# Altium schematic sheet MotoAVC - Aquisição.SchDoc: MotoAVC v1.0
size A4; Author: Felippe Kalil Mendonça; DrawnBy: Felippe Kalil Mendonça; Organization: LABSOLDA/UFSC; Address1: Campus Universitário; Address2: Trindade - Florianópolis - SC; Address3: Brasil; DocumentNumber: 1.0; SheetNumber: 1; SheetTotal: 1; ProjectName: MotoAVC
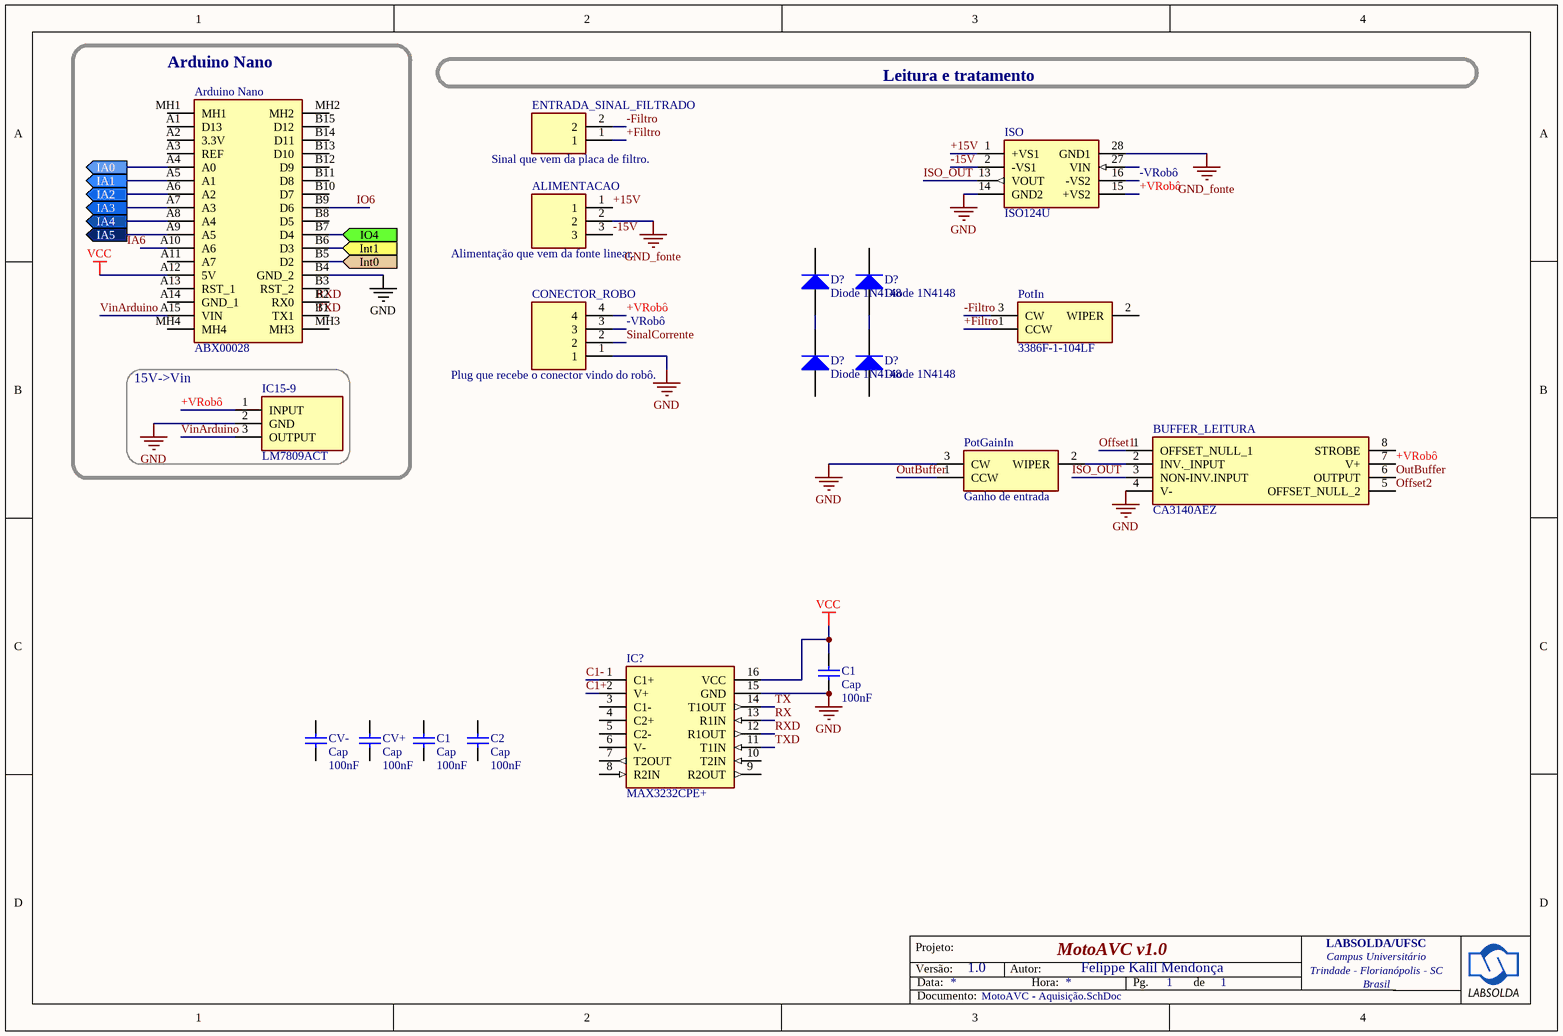
[diagram p0: MotoAVC - Aquisição.SchDoc]

## Parts
(Parts that share a designator on the sheet are numbered #1, #2 ... from top to bottom, then left to right.)
ALIMENTACAO  Alimentação que vem da fonte linear.  [0022053031]
Arduino_Nano  ABX00028  [ABX00028]
BUFFER_LEITURA  CA3140AEZ  [DIP794W56P254L958H533Q8N]
C1#1  Cap  value 100nF  [RAD-0.3]
C1#2  Cap  value 100nF  [RAD-0.3]
C2  Cap  value 100nF  [RAD-0.3]
CONECTOR_ROBO  Plug que recebe o conector vindo do robô.  [SHDR4W87P0X254_1X4_1001X635X1091P]
CV+  Cap  value 100nF  [RAD-0.3]
CV-  Cap  value 100nF  [RAD-0.3]
D?#1  Diode 1N4148  [DO-35]
D?#2  Diode 1N4148  [DO-35]
D?#3  Diode 1N4148  [DO-35]
D?#4  Diode 1N4148  [DO-35]
ENTRADA_SINAL_FILTRADO  Sinal que vem da placa de filtro.  [SHDR2W104P0X254_1X2_508X580X1205P]
IC15-9  LM7809ACT  [TO254P470X1016X2019-3P]
IC?  MAX3232CPE+  [DIP762W56P254L1918H457Q16N]
ISO  ISO124U  [ISO122U]
PotGainIn  Ganho de entrada  [3386F1153]
PotIn  3386F-1-104LF  [3386F1153]

## Blocks framed on the sheet
Arduino Nano: Arduino_Nano
15V->Vin: IC15-9

## Ports
IA0 (out), IA1 (out), IA2 (out), IA3 (out), IA4 (out), IA5 (out), Int0 (in), Int1 (in), IO4 (in)

## Nets
GND: Arduino_Nano.B4(GND_2) BUFFER_LEITURA.4(V-) C1#1.1 CONECTOR_ROBO.1 IC15-9.2(GND) IC?.15(GND) ISO.14(GND2) PotGainIn.3(CW)
GND_fonte: ALIMENTACAO.2 ISO.28(GND1)
VCC: Arduino_Nano.A12(5V) C1#1.2 IC?.16(VCC)
+15V: ALIMENTACAO.1 ISO.1(+VS1)
+Filtro: ENTRADA_SINAL_FILTRADO.1 PotIn.1(CCW)
+VRobô: BUFFER_LEITURA.7(V+) CONECTOR_ROBO.4 IC15-9.1(INPUT) ISO.15(+VS2)
-15V: ALIMENTACAO.3 ISO.2(-VS1)
-Filtro: ENTRADA_SINAL_FILTRADO.2 PotIn.3(CW)
-VRobô: CONECTOR_ROBO.3 ISO.16(-VS2)
C1+: IC?.2(V+)
C1-: IC?.1(C1+)
IA0: Arduino_Nano.A4(A0) ; port IA0
IA1: Arduino_Nano.A5(A1) ; port IA1
IA2: Arduino_Nano.A6(A2) ; port IA2
IA3: Arduino_Nano.A7(A3) ; port IA3
IA4: Arduino_Nano.A8(A4) ; port IA4
IA5: Arduino_Nano.A9(A5) ; port IA5
Int0: Arduino_Nano.B5(D2) ; port Int0
Int1: Arduino_Nano.B6(D3) ; port Int1
IO4: Arduino_Nano.B7(D4) ; port IO4
IO6: Arduino_Nano.B9(D6)
ISO_OUT: BUFFER_LEITURA.3(NON-INV.INPUT) ISO.13(VOUT)
Offset1: BUFFER_LEITURA.1(OFFSET_NULL_1)
Offset2: BUFFER_LEITURA.5(OFFSET_NULL_2)
OutBuffer: BUFFER_LEITURA.6(OUTPUT) PotGainIn.1(CCW)
RX: IC?.13(R1IN)
RXD: IC?.12(R1OUT)
SinalCorrente: CONECTOR_ROBO.2
TX: IC?.14(T1OUT)
TXD: IC?.11(T1IN)
VinArduino: Arduino_Nano.A15(VIN) IC15-9.3(OUTPUT)
NetBUFFER_LEITURA_2: BUFFER_LEITURA.2(INV._INPUT) PotGainIn.2(WIPER)
NetD?#1_1: D?#1.1(A) D?#3.2(K)
NetD?#2_1: D?#2.1(A) D?#4.2(K)

Not connected (* = marked no-connect by the designer): Arduino_Nano A1(D13) A2(3.3V) A3(REF) A10(A6) A11(A7) A13(RST_1) A14(GND_1) B1(TX1) B2(RX0) B3(RST_2) B8(D5) B10(D7) B11(D8) B12(D9) B13(D10) B14(D11) B15(D12) MH1 MH2 MH3 MH4; BUFFER_LEITURA 8(STROBE); C1#2 1 2; C2 1 2; CV+ 1 2; CV- 1 2; D?#1 2(K); D?#2 2(K); D?#3 1(A); D?#4 1(A); IC? 3(C1-) 4(C2+) 5(C2-) 6(V-) 7(T2OUT) 8(R2IN) 9(R2OUT) 10(T2IN); ISO 27(VIN); PotIn 2(WIPER)

## Notes on the sheet
- Leitura e tratamento
- Labels drawn without touching a wire or pin: IA6, RXD, TXD
- Versão:
- Projeto:
- Data:
- Autor:
- Hora:
- Pg.
- de
- Documento:

## Library data of the parts
ALIMENTACAO = 0022053031: Connector; Manufacturer_Name: Molex; Datasheet Link: https://www.molex.com/pdm_docs/sd/022053031_sd.pdf; Height: 6.6mm; Manufacturer_Part_Number: 0022053031; Arrow Part Number: 0022053031; Arrow Price/Stock: https://www.arrow.com/en/products/0022053031/molex; Mouser Part Number: N/A; Mouser Price/Stock: https://www.mouser.com/Search/Refine.aspx?Keyword=N%2FA
Arduino_Nano = ABX00028: Integrated Circuit; Manufacturer_Name: Arduino; Datasheet Link: https://store.arduino.cc/arduino-nano-every; Height: 10mm; Manufacturer_Part_Number: ABX00028; Mouser Part Number: 782-ABX00028; Mouser Price/Stock: https://www.mouser.co.uk/ProductDetail/Arduino/ABX00028?qs=PzGy0jfpSMtit6rnFl8mVg%3D%3D; RS Part Number: 1927586; RS Price/Stock: http://uk.rs-online.com/web/p/products/1927586
BUFFER_LEITURA = CA3140AEZ: Integrated Circuit; Manufacturer_Name: Renesas Electronics; Datasheet Link: https://www.renesas.com/en-us/www/doc/datasheet/ca3140-a.pdf; Height: 5.33mm; Manufacturer_Part_Number: CA3140AEZ; Mouser Part Number: 968-CA3140AEZ; Mouser Price/Stock: https://www.mouser.co.uk/ProductDetail/Renesas-Intersil/CA3140AEZ?qs=cbl4%252BYHJGOHUlWz8IZgCeg%3D%3D; RS Part Number: 9215563P; RS Price/Stock: http://uk.rs-online.com/web/p/products/9215563P
C1#1 C1#2 C2 CV+ CV- = Cap: Capacitor; Published: 8-Jun-2000; LatestRevisionDate: 17-Jul-2002; LatestRevisionNote: Re-released for DXP Platform.; PackageReference: RAD-0.3; Publisher: Altium Limited; PackageDescription: Radial Cap, Thru-Hole; 2 Leads; 0.3 in Pin Spacing
CONECTOR_ROBO = 0022232041: Connector; Manufacturer_Name: Molex; Datasheet Link: http://www.molex.com/pdm_docs/sd/022232041_sd.pdf; Height: 10.91mm; Manufacturer_Part_Number: 0022232041; Mouser Part Number: N/A; Mouser Price/Stock: https://www.mouser.com/Search/Refine.aspx?Keyword=N%2FA
D?#1-D?#4 = Diode 1N4148: High Conductance Fast Diode; Published: 8-Jun-2000; LatestRevisionDate: 17-Jul-2002; LatestRevisionNote: Re-released for DXP Platform.; DatasheetVersion: 1997; PackageReference: DO-35; Publisher: Altium Limited; PackageDescription: Diode, Axial; Body 3.8 x 1.9 mm (LxDia. max), Lead Dia. 0.53 mm (max); Code_JEDEC: DO-204-AH; ComponentLink1Description: Manufacturer Link; ComponentLink1URL: http://www.fairchildsemi.com/; ComponentLink2Description: Datasheet; ComponentLink2URL: http://www.fairchildsemi.com/ds/1N%2F1N4148.pdf
ENTRADA_SINAL_FILTRADO = 0022272021: Connector; Manufacturer_Name: Molex; Datasheet Link: https://www.molex.com/webdocs/datasheets/pdf/en-us/0022272021_PCB_HEADERS.pdf; Height: 12.05mm; Manufacturer_Part_Number: 0022272021; Mouser Part Number: N/A; Mouser Price/Stock: https://www.mouser.com/Search/Refine.aspx?Keyword=N%2FA
IC15-9 = LM7809ACT: Integrated Circuit; Manufacturer_Name: ON Semiconductor; Datasheet Link: https://www.mouser.com/datasheet/2/308/LM7809A-1306765.pdf; Height: 4.7mm; Manufacturer_Part_Number: LM7809ACT; Mouser Part Number: 512-LM7809ACT; Mouser Price/Stock: https://www.mouser.co.uk/ProductDetail/ON-Semiconductor-Fairchild/LM7809ACT?qs=VOMQJJE%252BBNnUX5YOd5%2Fz3w%3D%3D; RS Part Number: 8062845; RS Price/Stock: http://uk.rs-online.com/web/p/products/8062845
IC? = MAX3232CPE+: Integrated Circuit; Manufacturer_Name: Maxim Integrated; Datasheet Link: http://datasheets.maximintegrated.com/en/ds/MAX3222-MAX3241.pdf; Height: 4.572mm; Manufacturer_Part_Number: MAX3232CPE+; Mouser Part Number: 700-MAX3232CPE; Mouser Price/Stock: https://www.mouser.com/Search/Refine.aspx?Keyword=700-MAX3232CPE; RS Part Number: 1897981; RS Price/Stock: http://uk.rs-online.com/web/p/products/1897981
ISO = ISO124U: Integrated Circuit; Manufacturer_Name: Texas Instruments; Datasheet Link: http://www.ti.com/lit/ds/symlink/iso124.pdf; Height: 2.65mm; Manufacturer_Part_Number: ISO124U; Mouser Part Number: 595-ISO124U; Mouser Price/Stock: https://www.mouser.co.uk/ProductDetail/Texas-Instruments/ISO124U?qs=VBduBm9rCJQZw7ykoQ%2Fz8g%3D%3D; RS Part Number: 3008259P; RS Price/Stock: http://uk.rs-online.com/web/p/products/3008259P
PotGainIn = 3386F-1-103LF: Variable Resistor; Manufacturer_Name: Bourns; Allied_Number: 70154071; Datasheet Link: https://www.bourns.com/pdfs/3386.pdf; Height: 4.83mm; Manufacturer_Part_Number: 3386F-1-103LF; Mouser Part Number: 652-3386F-1-103LF; Mouser Price/Stock: https://www.mouser.co.uk/ProductDetail/Bourns/3386F-1-103LF?qs=nE0RJHjSZ6Uy1E1G8svoHg%3D%3D; RS Part Number: 5222227P; RS Price/Stock: http://uk.rs-online.com/web/p/products/5222227P; Allied Price/Stock: http://www.alliedelec.com/bourns-3386f-1-103lf/70154071/
PotIn = 3386F-1-104LF: Variable Resistor; Manufacturer_Name: Bourns; Datasheet Link: https://www.mouser.co.uk/datasheet/2/54/386-776606.pdf; Height: 4.83mm; Manufacturer_Part_Number: 3386F-1-104LF; Arrow Part Number: 3386F-1-104LF; Arrow Price/Stock: https://www.arrow.com/en/products/3386f-1-104lf/bourns; Mouser Part Number: 652-3386F-1-104LF; Mouser Price/Stock: https://www.mouser.co.uk/ProductDetail/Bourns/3386F-1-104LF?qs=nE0RJHjSZ6WRN3%252BQY8LjDg%3D%3D